# EAGLE schematic proximity_switch_connector_1p2 (EAGLE 9.5.2)
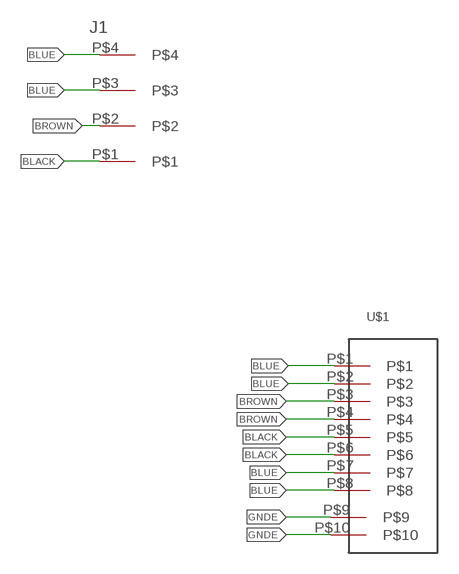
[diagram p0: schematic, sheet 1]

## Parts
J1  3.81MM_1_X_4_RT_ANGLE_PLUG_HEADER  [1X4_3.81MM_PITCH]
U$1  RJ45_SMTRJ  [RJ45_SMT]

## Nets
BLACK: J1.P$1 U$1.P$5 U$1.P$6
BLUE: J1.P$3 J1.P$4 U$1.P$1 U$1.P$2 U$1.P$7 U$1.P$8
BROWN: J1.P$2 U$1.P$3 U$1.P$4
GNDE: U$1.P$9 U$1.P$10

## Library data of the parts
J1 = 3D_MIG_Controller:3.81MM_1_X_4_RT_ANGLE_PLUG_HEADER
U$1 = 3D_MIG_Controller:RJ45_SMT